# Altium schematic sheet LATCHING_CIRCUITS.SchDoc
size A4
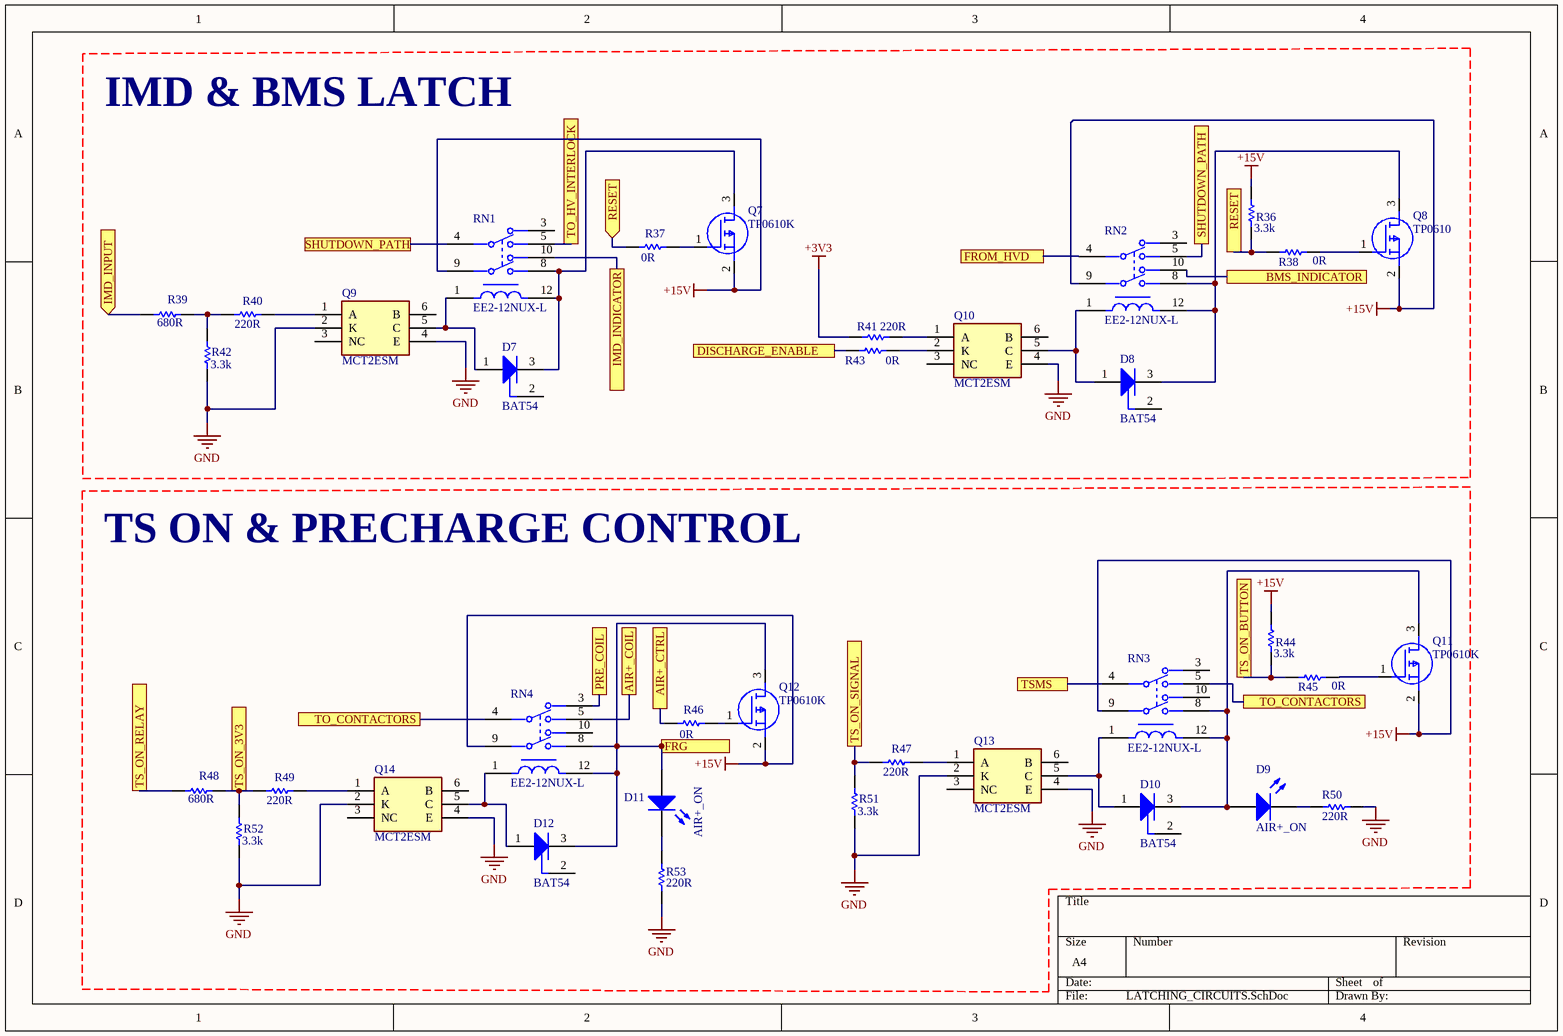
[diagram p0: LATCHING_CIRCUITS.SchDoc]

## Parts
D7  BAT54  [INF-SOT23_N]
D8  BAT54  [INF-SOT23_N]
D9  AIR+_ON  [3.2X1.6X1.1]
D10  BAT54  [INF-SOT23_N]
D11  AIR+_ON  [3.2X1.6X1.1]
D12  BAT54  [INF-SOT23_N]
Q7  TP0610K  [SOT96P240X110-3N]
Q8  TP0610  [SOT96P240X110-3N]
Q9  MCT2ESM  [SOT254P916X480-6N]
Q10  MCT2ESM  [SOT254P916X480-6N]
Q11  TP0610K  [SOT96P240X110-3N]
Q12  TP0610K  [SOT96P240X110-3N]
Q13  MCT2ESM  [SOT254P916X480-6N]
Q14  MCT2ESM  [SOT254P916X480-6N]
R36  3.3k  [RESC3216X60X45NL10T20 - duplicate]
R37  0R  [RESC3216X60X45NL10T20 - duplicate]
R38  0R  [RESC3216X60X45NL10T20 - duplicate]
R39  680R  [RESC3216X60X45NL10T20 - duplicate]
R40  220R  [RESC3216X60X45NL10T20 - duplicate]
R41  220R  [RESC3216X60X45NL10T20 - duplicate]
R42  3.3k  [RESC3216X60X45NL10T20 - duplicate]
R43  0R  [RESC3216X60X45NL10T20 - duplicate]
R44  3.3k  [RESC3216X60X45NL10T20 - duplicate]
R45  0R  [RESC3216X60X45NL10T20 - duplicate]
R46  0R  [RESC3216X60X45NL10T20 - duplicate]
R47  220R  [RESC3216X60X45NL10T20 - duplicate]
R48  680R  [RESC3216X60X45NL10T20 - duplicate]
R49  220R  [RESC3216X60X45NL10T20 - duplicate]
R50  220R  [RESC3216X60X45NL10T20 - duplicate]
R51  3.3k  [RESC3216X60X45NL10T20 - duplicate]
R52  3.3k  [RESC3216X60X45NL10T20 - duplicate]
R53  220R  [RESC3216X60X45NL10T20 - duplicate]
RN1  EE2-12NUX-L  [EE2-12NUX-L]
RN2  EE2-12NUX-L  [EE2-12NUX-L]
RN3  EE2-12NUX-L  [EE2-12NUX-L]
RN4  EE2-12NUX-L  [EE2-12NUX-L]

## Blocks framed on the sheet
IMD & BMS LATCH: D7 D8 Q7-Q10 R36-R43 RN1 RN2
TS ON & PRECHARGE CONTROL: D9-D12 Q11-Q14 R44-R53 RN3 RN4

## Ports
AIR+_COIL, AIR+_CTRL, BMS_INDICATOR, DISCHARGE_ENABLE, FRG, FROM_HVD, IMD_INDICATOR, IMD_INPUT (in), PRE_COIL, RESET, RESET (in), SHUTDOWN_PATH, TO_CONTACTORS, TO_HV_INTERLOCK, TS_ON_3V3, TS_ON_BUTTON, TS_ON_RELAY, TS_ON_SIGNAL, TSMS

## Nets
+3V3: R41.2
+15V: Q7.2(S) Q8.2(S) Q11.2(S) Q12.2(S) R36.2 R44.2 RN1.9 RN2.9 RN3.9 RN4.9
GND: Q9.2(K) Q9.4(E) Q10.4(E) Q13.2(K) Q13.4(E) Q14.2(K) Q14.4(E) R42.1 R50.1 R51.1 R52.1 R53.1
AIR+_COIL: RN4.5 ; port AIR+_COIL
AIR+_CTRL: R46.2 ; port AIR+_CTRL
BMS_INDICATOR: RN2.10 ; port BMS_INDICATOR
DISCHARGE_ENABLE: R43.2 ; port DISCHARGE_ENABLE
FRG: D11.1(A) D12.3(K) Q12.3(D) RN4.8 RN4.12 ; port FRG
FROM_HVD: RN2.4 ; port FROM_HVD
IMD_INDICATOR: RN1.10 ; port IMD_INDICATOR
IMD_INPUT: R39.2 ; port IMD_INPUT
PRE_COIL: RN4.3 ; port PRE_COIL
RESET: R36.1 R37.2 R38.2 ; port RESET
SHUTDOWN_PATH: RN1.4 RN2.5 ; port SHUTDOWN_PATH
TO_CONTACTORS: RN3.5 RN4.4 ; port TO_CONTACTORS
TO_HV_INTERLOCK: RN1.5 ; port TO_HV_INTERLOCK
TS_ON_3V3: R48.1 R49.2 R52.2 ; port TS_ON_3V3
TS_ON_BUTTON: R44.1 R45.2 ; port TS_ON_BUTTON
TS_ON_RELAY: R48.2 ; port TS_ON_RELAY
TS_ON_SIGNAL: R47.2 R51.2 ; port TS_ON_SIGNAL
TSMS: RN3.4 ; port TSMS
NetD7_1: D7.1(A) Q9.5(C) RN1.1
NetD7_3: D7.3(K) Q7.3(D) RN1.8 RN1.12
NetD8_1: D8.1(A) Q10.5(C) RN2.1
NetD8_3: D8.3(K) Q8.3(D) RN2.8 RN2.12
NetD9_1: D9.1(A) D10.3(K) Q11.3(D) RN3.8 RN3.12
NetD9_2: D9.2(K) R50.2
NetD10_1: D10.1(A) Q13.5(C) RN3.1
NetD11_2: D11.2(K) R53.2
NetD12_1: D12.1(A) Q14.5(C) RN4.1
NetQ7_1: Q7.1(G) R37.1
NetQ8_1: Q8.1(G) R38.1
NetQ9_1: Q9.1(A) R40.1
NetQ10_1: Q10.1(A) R41.1
NetQ10_2: Q10.2(K) R43.1
NetQ11_1: Q11.1(G) R45.1
NetQ12_1: Q12.1(G) R46.1
NetQ13_1: Q13.1(A) R47.1
NetQ14_1: Q14.1(A) R49.1
NetR39_1: R39.1 R40.2 R42.2

Not connected (* = marked no-connect by the designer): D7 2(NC); D8 2(NC); D10 2(NC); D12 2(NC); Q9 3(NC) 6(B); Q10 3(NC) 6(B); Q13 3(NC) 6(B); Q14 3(NC) 6(B); RN1 3; RN2 3; RN3 3 10; RN4 10

## Library data of the parts
D7 D8 D10 D12 = CMP-1182-00010-1: Silicon Schottky Diode, SOT23, Reel, Green; Manufacturer: Infineon; VF (max): 800Â mV; Configuration: Single; IF (max): 200Â mA; CT (max): 10Â pF; Green: TRUE; VR (max): 30Â V; PartNumber: BAT54; ComponentLink2URL: http://www.infineon.com/dgdl/bat54series.pdf?folderId=db3a30431400ef68011425f1ca2505e3&fileId=db3a304314dca3890115190b74210ea6; ComponentLink3Description: Package Specification; PackageVersion: Apr-08; PackageDescription: 3-Pin Small Outline Transistor Package, 1.3 x 2.9 mm Body, 0.95 mm Pitch; ComponentLink1Description: Manufacturer URL; ComponentLink1URL: http://www.infineon.com/; Mounting Technology: Surface Mount; Packing: Reel; ComponentLink2Description: Datasheet; PackageReference: SOT23; ComponentLink3URL: http://www.infineon.com/dgdl/SOT23-Package_Overview.pdf?folderId=db3a30431936bc4b0119532290053c66&fileId=db3a30431936bc4b0119533468123c85
D9 D11 = LED2: Typical RED, GREEN, YELLOW, AMBER GaAs LED; Published: 8-Jun-2000; LatestRevisionDate: 17-Jul-2002; LatestRevisionNote: Re-released for DXP Platform.; PackageVersion: Feb-2002; PackageReference: 3.2X1.6X1.1; Publisher: Altium Limited; PackageDescription: SM LED; 2 Flat Leads
Q7 Q8 Q11 Q12 = DMP3125L-7: MOSFET (P-Channel); Manufacturer_Name: Diodes Inc.; Datasheet Link: http://uk.rs-online.com/web/p/products/1826917; Height: 1.1mm; Manufacturer_Part_Number: DMP3125L-7; Mouser Part Number: 621-DMP3125L-7; Mouser Price/Stock: https://www.mouser.co.uk/ProductDetail/Diodes-Incorporated/DMP3125L-7?qs=W0yvOO0ixfH8ma8MdHfXQA%3D%3D; Arrow Part Number: DMP3125L-7; Arrow Price/Stock: https://www.arrow.com/en/products/dmp3125l-7/diodes-incorporated
Q9 Q10 Q13 Q14 = MCT2ESM: Phototransistor; Manufacturer_Name: ON Semiconductor; Datasheet Link: https://www.onsemi.com/pub/Collateral/MCT2EM-D.PDF; Height: 4.8mm; Manufacturer_Part_Number: MCT2ESM; Mouser Part Number: 512-MCT2ESM; Mouser Price/Stock: https://www.mouser.co.uk/ProductDetail/ON-Semiconductor-Fairchild/MCT2ESM/?qs=nW0pe8qlIZjLnc6UyUzYTw%3D%3D; Arrow Part Number: MCT2ESM; Arrow Price/Stock: https://www.arrow.com/en/products/mct2esm/on-semiconductor
R36-R53 = CMP-2003-02213-1: Part Number: CRCW120647K0FKEA; Manufacturer: Vishay Dale